# EAGLE schematic GIP-SIM900 (EAGLE 9.1.3)
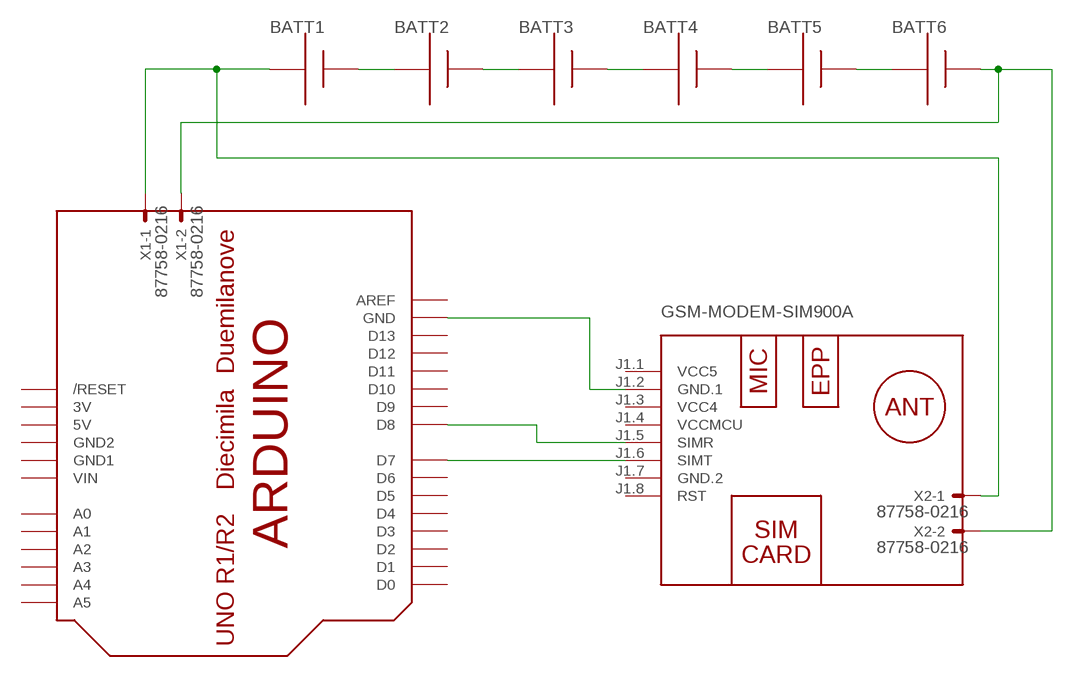
[diagram p0: schematic, sheet 1]

## Parts
BATT1  AAA  [12BH412]
BATT2  AAA  [12BH412]
BATT3  AAA  [12BH412]
BATT4  AAA  [12BH412]
BATT5  AAA  [12BH412]
BATT6  AAA  [12BH412]
U$1  GSM-MODEM-SIM900A  [GSM-MODEM-SIM900A]
U$2  ARDUINO-BPLACE  [ARDUINO-BPLACE]
X1  87758-0216  [87758-0216]
X2  87758-0216  [87758-0216]

## Nets
N$1: U$1.J1.2(GND.1) U$2.GND
N$2: U$1.J1.5(SIMR) U$2.D8
N$3: U$1.J1.6(SIMT) U$2.D7
N$4: BATT1.+ BATT2.-
N$10: BATT2.+ BATT3.-
N$11: BATT3.+ BATT4.-
N$12: BATT4.+ BATT5.-
N$13: BATT5.+ BATT6.-
N$14: BATT1.- X1.1 X2.1
N$15: BATT6.+ X1.2 X2.2
Unconnected: U$1.J1.8(RST) U$2.A0 U$2.A1 U$2.A2 U$2.A3 U$2.A4 U$2.A5 U$2.AREF U$2.D0 U$2.D1 U$2.D2 U$2.D3 U$2.D4 U$2.D5 U$2.D6 U$2.D9 U$2.D10 U$2.D11 U$2.D12 U$2.D13 U$2.RESET(/RESET)

## Power pins joined to a net without a drawn wire
3V: U$2.3V
5V: U$2.5V
GND1: U$2.GND1
GND2: U$2.GND2
GND.2: U$1.J1.7(GND.2)
VCC4: U$1.J1.3(VCC4)
VCC5: U$1.J1.1(VCC5)
VCCMCU: U$1.J1.4(VCCMCU)
VIN: U$2.VIN

## Library data of the parts
BATT1-BATT6 = adafruit:AAA: AAA PC pin holder Mouser part #12BH412 - but pretty much any 1x AAA battery holder should be the same http://www.ladyada.net/library/pcb/eaglelibrary.html
U$1 = diy-modules:GSM-MODEM-SIM900A: GSM Mini Module based on SIM900A Schematic available here: http://www.electrodragon.com/w/SIM900_(SIM900A)_Mini_DEV_Board
U$2 = adafruit:ARDUINO: Arduino Diecimila/Duemilanove Make a shield with ease, this package has all the named pins as well as the two mounting drill holes and an outline of the USB and DC power connector. The outline is on the DIMENSION layer, so if your board house uses it they will cut the outline to match. http://www.ladyada.net/library/pcb/eaglelibrary.html
X1 X2 = con-molex:87758-0216: 2 Pin - 2mm Dual Row Single Wafer, Vertical T/H HDR Source: http://www.molex.com/pdm_docs/sd/877580616_sd.pdf; MF: MOLEX; MPN: 87758-0216; OC_FARNELL: unknown; OC_NEWARK: 94M1513